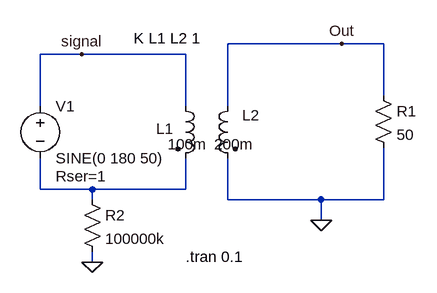
[diagram p0: schematic Transform1.asc]
Transform1.asc, the LTspice schematic file:
Version 4
SHEET 1 880 680
WIRE 336 -16 160 -16
WIRE 400 -16 336 -16
WIRE -64 0 -128 0
WIRE 96 0 -64 0
WIRE 400 64 400 -16
WIRE -128 80 -128 0
WIRE 96 80 96 0
WIRE 160 80 160 -16
WIRE -128 208 -128 160
WIRE -48 208 -128 208
WIRE 96 208 96 160
WIRE 96 208 -48 208
WIRE -48 224 -48 208
WIRE 160 224 160 160
WIRE 304 224 160 224
WIRE 400 224 400 144
WIRE 400 224 304 224
WIRE 304 256 304 224
WIRE -48 320 -48 304
FLAG 304 256 0
FLAG -48 320 0
FLAG -64 0 signal
FLAG 336 -16 Out
SYMBOL ind2 80 64 R0
WINDOW 0 -30 51 Left 2
WINDOW 3 -12 75 Left 2
SYMATTR InstName L1
SYMATTR Value 100m
SYMATTR Type ind
SYMBOL ind2 176 64 M0
WINDOW 0 -34 30 Left 2
WINDOW 3 -24 75 Left 2
SYMATTR InstName L2
SYMATTR Value 200m
SYMATTR Type ind
SYMBOL voltage -128 64 R0
WINDOW 123 0 0 Left 0
WINDOW 39 24 124 Left 2
SYMATTR SpiceLine Rser=1
SYMATTR InstName V1
SYMATTR Value SINE(0 180 50)
SYMBOL res 384 48 R0
SYMATTR InstName R1
SYMATTR Value 50
SYMBOL res -64 208 R0
SYMATTR InstName R2
SYMATTR Value 100000k
TEXT 16 -24 Left 2 !K L1 L2 1
TEXT 96 312 Left 2 !.tran 0.1

The netlist it stands for:
* Transform1.asc
L1 signal N001 100m
L2 Out 0 200m
V1 signal N001 SINE(0 180 50) Rser=1
R1 Out 0 50
R2 N001 0 100000k
K L1 L2 1
.tran 0.1
.backanno
.end